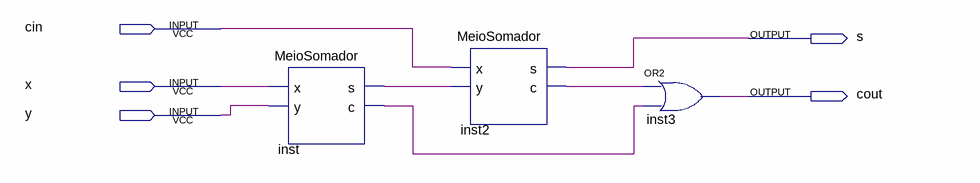
[diagram p0: schematic sheet]
// Quartus schematic Somador_Completo.bdf as structural Verilog: 3 symbols, 5 pins
module Somador_Completo (
  input  cin,
  input  x,
  input  y,
  output s,
  output cout
);

  wire inst2_c, inst_c, inst_s;

  MeioSomador inst (.x(x), .y(y), .s(inst_s), .c(inst_c));
  MeioSomador inst2 (.x(cin), .y(inst_s), .s(s), .c(inst2_c));
  or inst3 (cout, inst2_c, inst_c);
endmodule
